# Altium schematic sheet RS485.SchDoc
size A4
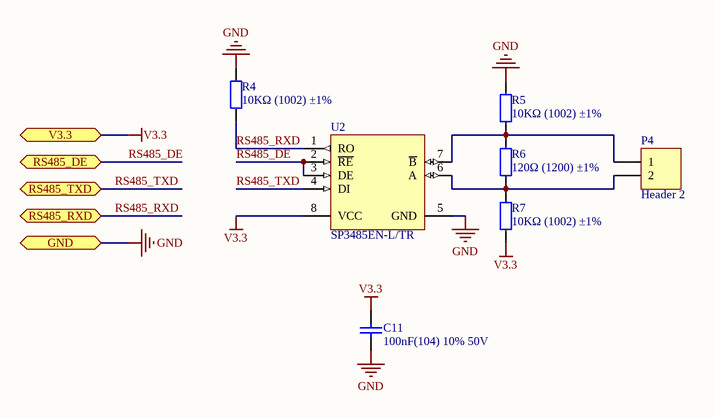
[diagram p0: RS485.SchDoc]

## Parts
C11  100nF(104) 10% 50V  [0805_C]
P4  Header 2  [KF128-2P]
R4  10KΩ (1002) ±1%  [0805_R]
R5  10KΩ (1002) ±1%  [0805_R]
R6  120Ω (1200) ±1%  [0805_R]
R7  10KΩ (1002) ±1%  [0805_R]
U2  SP3485EN-L/TR  [SOIC-8_150mil]

## Ports
GND, RS485_DE, RS485_RXD, RS485_TXD, V3.3

## Nets
GND: C11.2 R4.2 R5.2 U2.5(GND) ; port GND
V3.3: C11.1 R7.1 U2.8(VCC) ; port V3.3
RS485_DE: U2.2(~{RE}) U2.3(DE) ; port RS485_DE
RS485_RXD: R4.1 U2.1(RO) ; port RS485_RXD
RS485_TXD: U2.4(DI) ; port RS485_TXD
NetP4_1: P4.1 R5.1 R6.2 U2.7(~{B})
NetP4_2: P4.2 R6.1 R7.2 U2.6(A)

## Library data of the parts
C11 = 0805 100nF(104) 10% 50V: 贴片电容; ComponentLink1Description: 供应商链接; ComponentLink1URL: http://www.szlcsc.com/product/details_50686.html; Package: 0805; Supplier: LC; SuppliersPartNumber: C49678
P4 = Header 2: Header, 2-Pin; LatestRevisionDate: 17-Jul-2002; LatestRevisionNote: Re-released for DXP Platform.; Publisher: Altium Limited
R4 R5 R7 = 0805 10KΩ (1002) 1%: 贴片电阻; ComponentLink1Description: 供应商链接; ComponentLink1URL: http://www.szlcsc.com/product/details_18102.html; Package: 0805; Supplier: LC; SuppliersPartNumber: C17414
R6 = 0805 120Ω (1200) 1%: 贴片电阻; ComponentLink1Description: 供应商链接; ComponentLink1URL: http://www.szlcsc.com/product/details_18125.html; Package: 0805; Supplier: LC; SuppliersPartNumber: C17437
U2 = SP3485EN-L/TR_[C8963]: RS-485/RS-422; ComponentLink1Description: 供应商链接; ComponentLink1URL: http://www.szlcsc.com/product/details_9482.html; Package: SOIC-8; Supplier: LC; SuppliersPartNumber: C8963